# Altium schematic sheet Sheet1.SchDoc
size A4; SheetNumber: 1; SheetTotal: 1
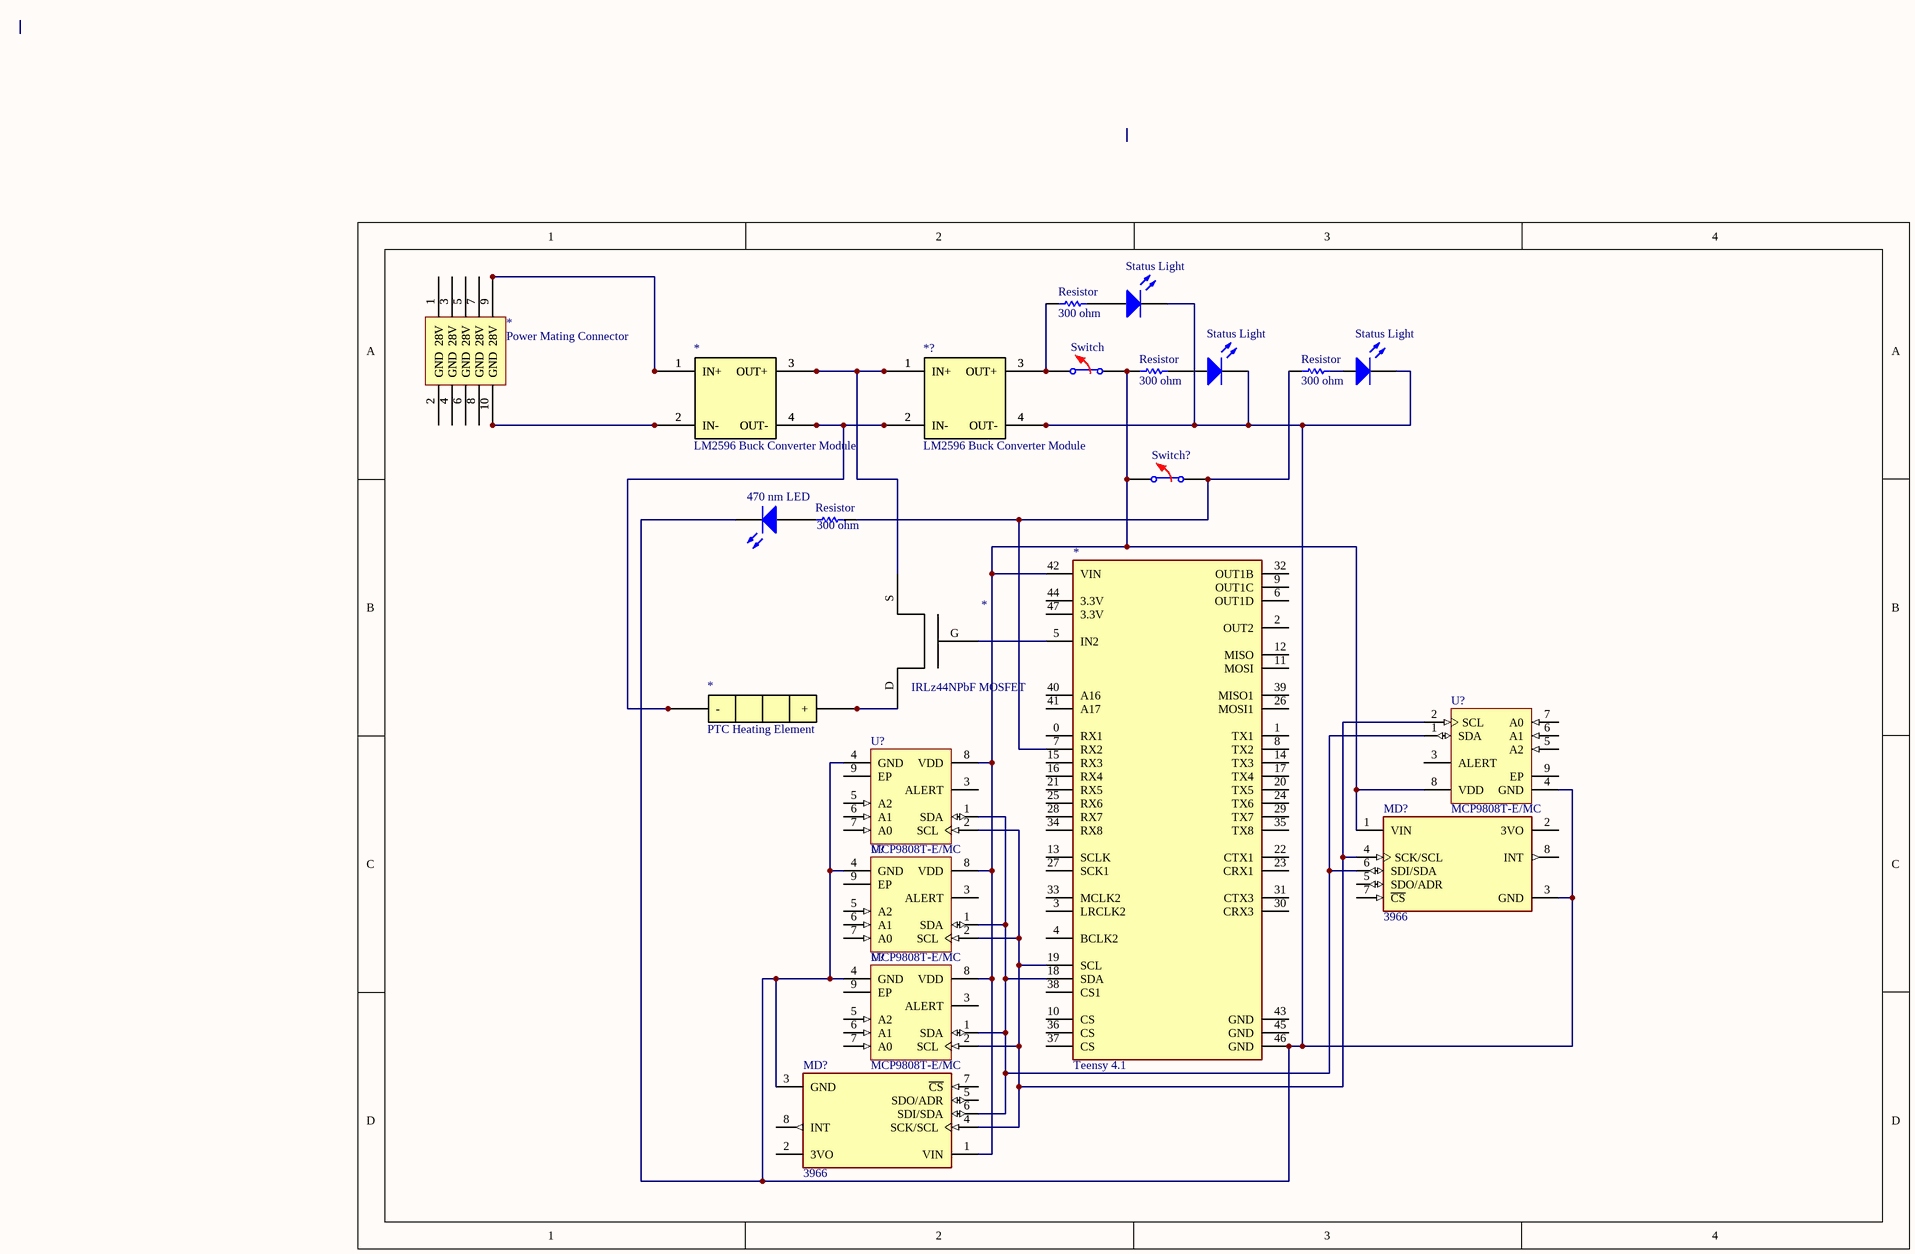
[diagram p0: Sheet1.SchDoc]

## Parts
(Parts that share a designator on the sheet are numbered #1, #2 ... from top to bottom, then left to right.)
470_nm_LED  Light-Emitting Diode  (value not drawn)
*#1  Power Mating Connector
*#2  LM2596 Buck Converter Module
*#3  Teensy 4.1  [FP-DEV-16996-MFG]
*#4  IRLz44NPbF MOSFET
*#5  PTC Heating Element
*?  LM2596 Buck Converter Module
MD?#1  3966  [FP-3966-MFG]
MD?#2  3966  [FP-3966-MFG]
Resistor#1  value 300 ohm  (hidden comment: Resistor)
Resistor#2  value 300 ohm  (hidden comment: Resistor)
Resistor#3  value 300 ohm  (hidden comment: Resistor)
Resistor#4  value 300 ohm  (hidden comment: Resistor)
Status_Light#1  Light-Emitting Diode  (value not drawn)
Status_Light#2  Light-Emitting Diode  (value not drawn)
Status_Light#3  Light-Emitting Diode  (value not drawn)
Switch  Switch Normally Closed  (value not drawn)
Switch?  Switch Normally Closed  (value not drawn)
U?#1  MCP9808T-E/MC  [MCHP-DFN-MC8_V]
U?#2  MCP9808T-E/MC  [MCHP-DFN-MC8_V]
U?#3  MCP9808T-E/MC  [MCHP-DFN-MC8_V]
U?#4  MCP9808T-E/MC  [MCHP-DFN-MC8_V]

## Nets
Net470_nm_LED_1: 470_nm_LED.1(A) Resistor#4.1
Net470_nm_LED_2: 470_nm_LED.2(K) *#3.46(GND) *?.4(OUT-) MD?#1.3(GND) MD?#2.3(GND) Status_Light#1.2(K) Status_Light#2.2(K) Status_Light#3.2(K) U?#1.4(GND) U?#2.4(GND) U?#3.4(GND) U?#4.4(GND)
Net*#1_9: *#1.9(28V) *#2.1(IN+)
Net*#1_10: *#1.10(GND) *#2.2(IN-)
Net*#2_3: *#2.3(OUT+) *#4.S *?.1(IN+)
Net*#2_4: *#2.4(OUT-) *#5.?1(-) *#5.?2(-) *?.2(IN-)
Net*#3_5: *#3.5(IN2) *#4.G
Net*#3_7: *#3.7(RX2) Resistor#3.1 Resistor#4.2 Switch?.2
Net*#3_18: *#3.18(SDA) MD?#1.6(SDI/SDA) MD?#2.6(SDI/SDA) U?#1.1(SDA) U?#2.1(SDA) U?#3.1(SDA) U?#4.1(SDA)
Net*#3_19: *#3.19(SCL) MD?#1.4(SCK/SCL) MD?#2.4(SCK/SCL) U?#1.2(SCL) U?#2.2(SCL) U?#3.2(SCL) U?#4.2(SCL)
Net*#3_42: *#3.42(VIN) MD?#1.1(VIN) MD?#2.1(VIN) Resistor#2.1 Switch.2 Switch?.1 U?#1.8(VDD) U?#2.8(VDD) U?#3.8(VDD) U?#4.8(VDD)
Net*#4_D: *#4.D *#5.8(+)
Net*?_3: *?.3(OUT+) Resistor#1.1 Switch.1
NetResistor#1_2: Resistor#1.2 Status_Light#1.1(A)
NetResistor#2_2: Resistor#2.2 Status_Light#2.1(A)
NetResistor#3_2: Resistor#3.2 Status_Light#3.1(A)

Not connected (* = marked no-connect by the designer): *#1 1(28V) 2(GND) 3(28V) 4(GND) 5(28V) 6(GND) 7(28V) 8(GND); *#3 0(RX1) 1(TX1) 2(OUT2) 3(LRCLK2) 4(BCLK2) 6(OUT1D) 8(TX2) 9(OUT1C) 10(CS) 11(MOSI) 12(MISO) 13(SCLK) 14(TX3) 15(RX3) 16(RX4) 17(TX4) 20(TX5) 21(RX5) 22(CTX1) 23(CRX1) 24(TX6) 25(RX6) 26(MOSI1) 27(SCK1) 28(RX7) 29(TX7) 30(CRX3) 31(CTX3) 32(OUT1B) 33(MCLK2) 34(RX8) 35(TX8) 36(CS) 37(CS) 38(CS1) 39(MISO1) 40(A16) 41(A17) 43(GND) 44(3.3V) 45(GND) 47(3.3V); MD?#1 2(3VO) 5(SDO/ADR) 7(~{CS}) 8(INT); MD?#2 2(3VO) 5(SDO/ADR) 7(~{CS}) 8(INT); U?#1 3(ALERT) 5(A2) 6(A1) 7(A0) 9(EP); U?#2 3(ALERT) 5(A2) 6(A1) 7(A0) 9(EP); U?#3 3(ALERT) 5(A2) 6(A1) 7(A0) 9(EP); U?#4 3(ALERT) 5(A2) 6(A1) 7(A0) 9(EP)

## Library data of the parts
470_nm_LED Status_Light#1-Status_Light#3 = LED: AF: 1; BV: 0; BV_MAX: 1e99; EG: 1.11; FC: 0.5; IBV: 0.001; IS: 1e-14; MJSW: 0.33; NTUN: 30; TNOM: 27; XTI: 3; SimulationGenericComponent: True; CJO: 0; CJP: 0; CTA: 0; CTP: 0; FCS: 0.5; FV_MAX: 1e99; IKF: 0; IKR: 0; ISR: 1e-14; JSW: 0; JTUN: 0; JTUNSW: 0; KEG: 1; KF: 0; LEVEL: 1; N: 1; NBV: 1; NR: 1; NS: 1; PHP: 1; RS: 0; TCV: 0; TLEV: 0; TLEVC: 0; TM1: 0; TM2: 0; TPB: 0; TPHP: 0; TRS: 0; TRS2: 0; TT: 0; TTT1: 0; TTT2: 0; VJ: 1; XTITUN: 3
*#3 = CMP-157412-000001-1: TEENSY 4.1 (HEADERS)
*#4 = IRLz44NPbF
MD?#1 MD?#2 = CMP-144239-000001-1: BMP388 - PRECISION BAROMETRIC PR
Resistor#1-Resistor#4 = Resistor: TC1: 0; SimulationGenericComponent: True; TC2: 0
Switch Switch? = SW NC: closed: 1; Rclosed: 1m; Ropen: 1Meg; SimulationGenericComponent: True
U?#1-U?#4 = CMP-0192-00342-1: + / - 0.5 degC Maximum Accuracy Digital Temperature Sensor, 400 uA, 2.7 to 5.5 V, -40 to 125 degC, 8-pin DFN (MC8), Tape and Reel; Manufacturer: Microchip; DatasheetVersion: Rev. A; PartNumber: MCP9808T-E/MC; Mounting Technology: Surface Mount; ComponentLink4Description: Product URL; ComponentLink2URL: http://ww1.microchip.com/downloads/en/DeviceDoc/25095A.pdf; ComponentLink4URL: http://www.microchip.com/MCP9808; ComponentLink1Description: Manufacturer URL; ComponentLink3URL: http://www.microchip.com/stellent/groups/techpub_sg/documents/packagingspec/en012702.pdf; PackageDescription: 8-Lead Plastic Dual Flat, 2 x 3 mm Body, 0.5 mm Pitch; PackageVersion: C04-123C; PackageReference: DFN-MC8; ComponentLink2Description: Datasheet; ComponentLink1URL: http://www.microchip.com; ComponentLink3Description: Package Specification